# Altium schematic sheet audio.SchDoc
size A4
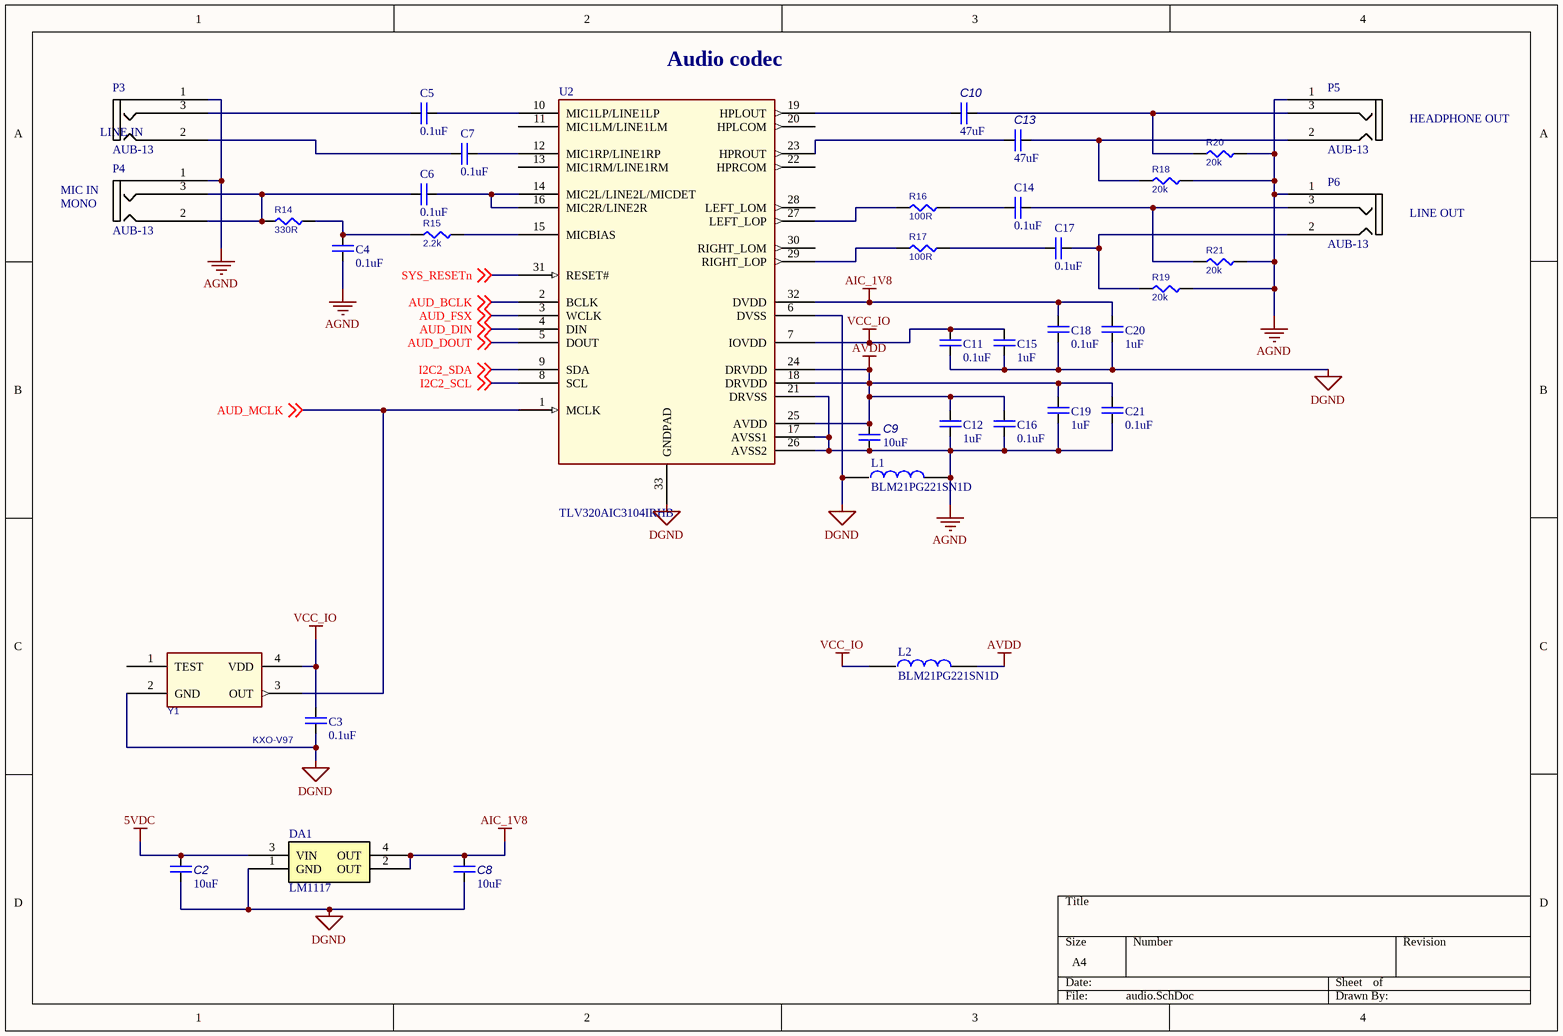
[diagram p0: audio.SchDoc]

## Parts
C2  value 10uF  [CC2012-0805]  (hidden comment: C0805)
C3  value 0.1uF  [CHIP0603]  (hidden comment: C0603)
C4  value 0.1uF  [CHIP0603]  (hidden comment: C0603)
C5  value 0.1uF  [CHIP0603]  (hidden comment: C0603)
C6  value 0.1uF  [CHIP0603]  (hidden comment: C0603)
C7  value 0.1uF  [CHIP0603]  (hidden comment: C0603)
C8  value 10uF  [CC2012-0805]  (hidden comment: C0805)
C9  value 10uF  [CC2012-0805]  (hidden comment: C0805)
C10  value 47uF  [CC3216-1206]  (hidden comment: C1206)
C11  value 0.1uF  [CHIP0603]  (hidden comment: C0603)
C12  value 1uF  [CHIP0603]  (hidden comment: C0603)
C13  value 47uF  [CC3216-1206]  (hidden comment: C1206)
C14  value 0.1uF  [CHIP0603]  (hidden comment: C0603)
C15  value 1uF  [CHIP0603]  (hidden comment: C0603)
C16  value 0.1uF  [CHIP0603]  (hidden comment: C0603)
C17  value 0.1uF  [CHIP0603]  (hidden comment: C0603)
C18  value 0.1uF  [CHIP0603]  (hidden comment: C0603)
C19  value 1uF  [CHIP0603]  (hidden comment: C0603)
C20  value 1uF  [CHIP0603]  (hidden comment: C0603)
C21  value 0.1uF  [CHIP0603]  (hidden comment: C0603)
DA1  LM1117  [SOT230P700X160-4N]
L1  BLM21PG221SN1D  [Chip2PinSM127P600-8N]
L2  BLM21PG221SN1D  [Chip2PinSM127P600-8N]
P3  AUB-13  [AUB_13]
P4  AUB-13  [AUB_13]
P5  AUB-13  [AUB_13]
P6  AUB-13  [AUB_13]
R14  value 330R  [CHIP0603]  (hidden comment: R0603)
R15  value 2.2k  [CHIP0603]  (hidden comment: R0603)
R16  value 100R  [CHIP0603]  (hidden comment: R0603)
R17  value 100R  [CHIP0603]  (hidden comment: R0603)
R18  value 20k  [CHIP0603]  (hidden comment: R0603)
R19  value 20k  [CHIP0603]  (hidden comment: R0603)
R20  value 20k  [CHIP0603]  (hidden comment: R0603)
R21  value 20k  [CHIP0603]  (hidden comment: R0603)
U2  Man P/N: TLV320AIC3104IRHB  [QFN32]  (hidden comment: TLV320AIC3104)
Y1  KXO-V97  [KXO_V97]

## Nets
5VDC: C2.2 DA1.3(VIN)
AGND: C4.1 C9.1 C12.2 C16.2 C19.2 C21.2 L1.2 P3.1(GND) P4.1(GND) P5.1(GND) P6.1(GND) R18.1 R19.1 R20.1 R21.1 U2.17(AVSS1) U2.21(DRVSS) U2.26(AVSS2)
AIC_1V8: C8.2 C18.1 C20.1 DA1.2(OUT) DA1.4(OUT) U2.32(DVDD)
AVDD: C9.2 C12.1 C16.1 C19.1 C21.1 L2.2 U2.18(DRVDD) U2.24(DRVDD) U2.25(AVDD)
DGND: C2.1 C3.2 C8.1 C11.2 C15.2 C18.2 C20.2 DA1.1(GND) L1.1 U2.6(DVSS) U2.33(GNDPAD) Y1.2(GND)
VCC_IO: C3.1 C11.1 C15.1 L2.1 U2.7(IOVDD) Y1.4(VDD)
AUD_BCLK: U2.2(BCLK) ; off-sheet AUD_BCLK
AUD_DIN: U2.4(DIN) ; off-sheet AUD_DIN
AUD_DOUT: U2.5(DOUT) ; off-sheet AUD_DOUT
AUD_FSX: U2.3(WCLK) ; off-sheet AUD_FSX
AUD_MCLK: U2.1(MCLK) Y1.3(OUT) ; off-sheet AUD_MCLK
I2C2_SCL: U2.8(SCL) ; off-sheet I2C2_SCL
I2C2_SDA: U2.9(SDA) ; off-sheet I2C2_SDA
SYS_RESETn: U2.31(RESET#) ; off-sheet SYS_RESETn
NetC4_2: C4.2 R14.2 R15.1
NetC5_1: C5.1 P3.3(LEFT)
NetC5_2: C5.2 U2.10(MIC1LP/LINE1LP)
NetC6_1: C6.1 P4.2(RIGHT) P4.3(LEFT) R14.1
NetC6_2: C6.2 U2.14(MIC2L/LINE2L/MICDET) U2.16(MIC2R/LINE2R)
NetC7_1: C7.1 P3.2(RIGHT)
NetC7_2: C7.2 U2.12(MIC1RP/LINE1RP)
NetC10_1: C10.1 P5.3(LEFT) R20.2
NetC10_2: C10.2 U2.19(HPLOUT)
NetC13_1: C13.1 P5.2(RIGHT) R18.2
NetC13_2: C13.2 U2.23(HPROUT)
NetC14_1: C14.1 R16.2
NetC14_2: C14.2 P6.3(LEFT) R21.2
NetC17_1: C17.1 R17.2
NetC17_2: C17.2 P6.2(RIGHT) R19.2
NetR15_2: R15.2 U2.15(MICBIAS)
NetR16_1: R16.1 U2.27(LEFT_LOP)
NetR17_1: R17.1 U2.29(RIGHT_LOP)

Not connected (* = marked no-connect by the designer): U2 11(MIC1LM/LINE1LM) 13(MIC1RM/LINE1RM) 20(HPLCOM) 22(HPRCOM) 28(LEFT_LOM) 30(RIGHT_LOM); Y1 1(TEST)

## Notes on the sheet
- (near U2) Audio codec
- LINE IN
- HEADPHONE OUT
- MIC IN
  MONO
- LINE OUT

## Library data of the parts
C3-C7 C11 C12 C14-C21 = C0603: Ceramic capacitor C0603
DA1 = LM1117: 800mA Low-Dropout Linear Regulator; Manufacturer: National; Man P/N: LM1117IMPX-3.3; Package: 3-lead  SOT-223
L1 L2 = BLM21PG221SN1D: Manufacturer: Murata; Man P/N: MMZ1608R301A
P3-P6 = AUB-13: Audio connector mini-jack 3.5mm, 3 pins; Vendor: brownbear.ru
R14-R21 = R0603: Resistor 0603
U2 = TLV320AIC3104: LOW-POWER STEREO AUDIO CODEC FOR PORTABLE AUDIO/TELEPHONY; Manufacturer: TI
Y1 = KXO-V97: Quartz oscillator 7x5mm; Manufacturer: Geyer; Value: *; Man P/N: KXO-V97
C2 C8 C9 = C0805: P/N: *
C10 C13 = C1206: P/N: *